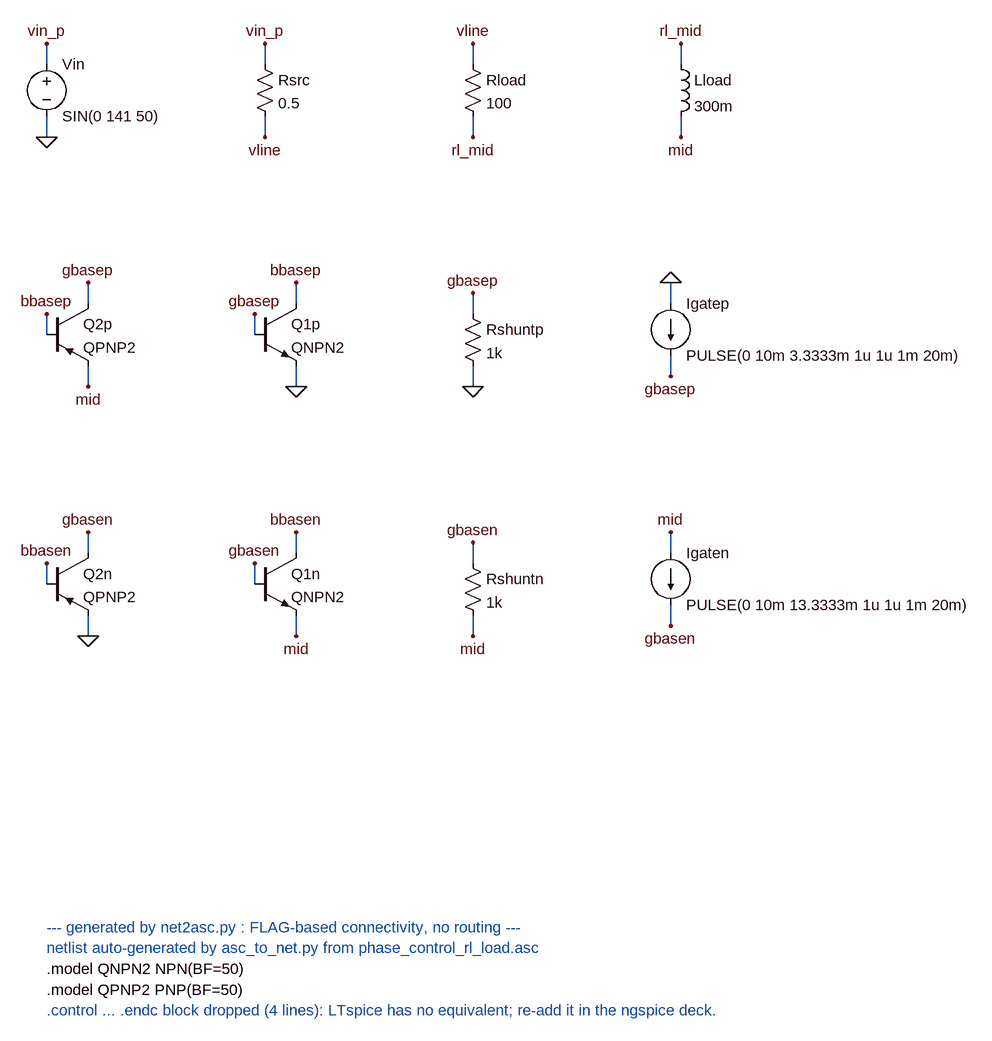
[diagram p0: schematic phase_control_rl_load.asc]
phase_control_rl_load.asc, the LTspice schematic file:
Version 4
SHEET 1 1376 1672
WIRE 0 16 0 -16
WIRE 0 96 0 128
WIRE 336 16 336 -16
WIRE 336 96 336 128
WIRE 656 16 656 -16
WIRE 656 96 656 128
WIRE 976 16 976 -16
WIRE 976 96 976 128
WIRE 64 384 64 352
WIRE 0 432 0 400
WIRE 64 480 64 512
WIRE 384 384 384 352
WIRE 320 432 320 400
WIRE 384 480 384 512
WIRE 656 400 656 368
WIRE 656 480 656 512
WIRE 960 384 960 352
WIRE 960 464 960 496
WIRE 64 768 64 736
WIRE 0 816 0 784
WIRE 64 864 64 896
WIRE 384 768 384 736
WIRE 320 816 320 784
WIRE 384 864 384 896
WIRE 656 784 656 752
WIRE 656 864 656 896
WIRE 960 768 960 736
WIRE 960 848 960 880
FLAG 0 -16 vin_p
FLAG 0 128 0
FLAG 336 -16 vin_p
FLAG 336 128 vline
FLAG 656 -16 vline
FLAG 656 128 rl_mid
FLAG 976 -16 rl_mid
FLAG 976 128 mid
FLAG 64 352 gbasep
FLAG 0 400 bbasep
FLAG 64 512 mid
FLAG 384 352 bbasep
FLAG 320 400 gbasep
FLAG 384 512 0
FLAG 656 368 gbasep
FLAG 656 512 0
FLAG 960 352 0
FLAG 960 496 gbasep
FLAG 64 736 gbasen
FLAG 0 784 bbasen
FLAG 64 896 0
FLAG 384 736 bbasen
FLAG 320 784 gbasen
FLAG 384 896 mid
FLAG 656 752 gbasen
FLAG 656 896 mid
FLAG 960 736 mid
FLAG 960 880 gbasen
SYMBOL voltage 0 0 R0
SYMATTR InstName Vin
SYMATTR Value SIN(0 141 50)
SYMBOL res 320 0 R0
SYMATTR InstName Rsrc
SYMATTR Value 0.5
SYMBOL res 640 0 R0
SYMATTR InstName Rload
SYMATTR Value 100
SYMBOL ind 960 0 R0
SYMATTR InstName Lload
SYMATTR Value 300m
SYMBOL pnp 0 384 R0
SYMATTR InstName Q2p
SYMATTR Value QPNP2
SYMBOL npn 320 384 R0
SYMATTR InstName Q1p
SYMATTR Value QNPN2
SYMBOL res 640 384 R0
SYMATTR InstName Rshuntp
SYMATTR Value 1k
SYMBOL current 960 384 R0
SYMATTR InstName Igatep
SYMATTR Value PULSE(0 10m 3.3333m 1u 1u 1m 20m)
SYMBOL pnp 0 768 R0
SYMATTR InstName Q2n
SYMATTR Value QPNP2
SYMBOL npn 320 768 R0
SYMATTR InstName Q1n
SYMATTR Value QNPN2
SYMBOL res 640 768 R0
SYMATTR InstName Rshuntn
SYMATTR Value 1k
SYMBOL current 960 768 R0
SYMATTR InstName Igaten
SYMATTR Value PULSE(0 10m 13.3333m 1u 1u 1m 20m)
TEXT 0 1344 Left 2 ;--- generated by net2asc.py : FLAG-based connectivity, no routing ---
TEXT 0 1376 Left 2 ;netlist auto-generated by asc_to_net.py from phase_control_rl_load.asc
TEXT 0 1408 Left 2 !.model QNPN2 NPN(BF=50)
TEXT 0 1440 Left 2 !.model QPNP2 PNP(BF=50)
TEXT 0 1472 Left 2 ;.control ... .endc block dropped (4 lines): LTspice has no equivalent; re-add it in the ngspice deck.

The netlist it stands for:
* phase_control_rl_load.asc
Vin vin_p 0 SIN(0 141 50)
Rsrc vin_p vline 0.5
Rload vline rl_mid 100
Lload rl_mid mid 300m
Q2p gbasep bbasep mid 0 QPNP2
Q1p bbasep gbasep 0 0 QNPN2
Rshuntp gbasep 0 1k
Igatep 0 gbasep PULSE(0 10m 3.3333m 1u 1u 1m 20m)
Q2n gbasen bbasen 0 0 QPNP2
Q1n bbasen gbasen mid 0 QNPN2
Rshuntn gbasen mid 1k
Igaten mid gbasen PULSE(0 10m 13.3333m 1u 1u 1m 20m)
.model NPN NPN
.model PNP PNP
.lib standard.bjt
* --- generated by net2asc.py : FLAG-based connectivity, no routing ---
* netlist auto-generated by asc_to_net.py from phase_control_rl_load.asc
.model QNPN2 NPN(BF=50)
.model QPNP2 PNP(BF=50)
* .control ... .endc block dropped (4 lines): LTspice has no equivalent; re-add it in the ngspice deck.
.backanno
.end